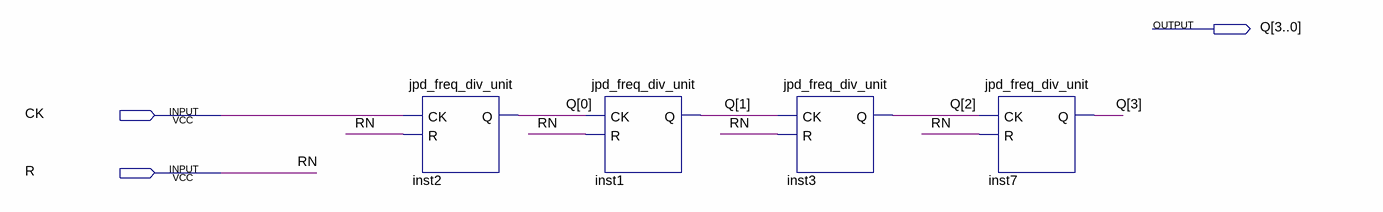
[diagram p0: schematic sheet]
// Quartus schematic jpd_freq_div_4.bdf as structural Verilog: 4 symbols, 3 pins
module jpd_freq_div_4 (
  input  CK,
  input  R,
  output [3:0] Q
);

  jpd_freq_div_unit inst2 (.CK(CK), .R(R), .Q(Q[0]));
  jpd_freq_div_unit inst1 (.CK(Q[0]), .R(R), .Q(Q[1]));
  jpd_freq_div_unit inst3 (.CK(Q[1]), .R(R), .Q(Q[2]));
  jpd_freq_div_unit inst7 (.CK(Q[2]), .R(R), .Q(Q[3]));

  // Other names for the same wires on the sheet: RN = R
endmodule
